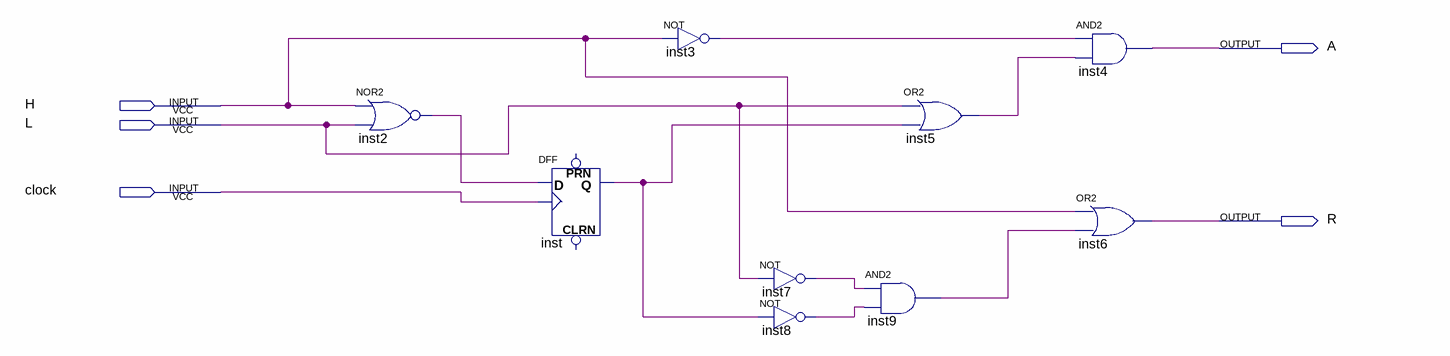
[diagram p0: schematic sheet]
// Quartus schematic robo_seguidor_de_parede.bdf as structural Verilog: 9 symbols, 5 pins
module robo_seguidor_de_parede (
  input  H,
  input  L,
  input  clock,
  output A,
  output R
);

  wire inst2_out, inst3_out, inst5_out, inst7_out, inst8_out, inst9_out, inst_q;

  nor inst2 (inst2_out, H, L);
  DFF inst (.CLK(clock), .D(inst2_out), .Q(inst_q));  // open: CLRN, PRN
  not inst3 (inst3_out, H);
  not inst7 (inst7_out, L);
  not inst8 (inst8_out, inst_q);
  or inst5 (inst5_out, L, inst_q);
  and inst9 (inst9_out, inst7_out, inst8_out);
  and inst4 (A, inst3_out, inst5_out);
  or inst6 (R, H, inst9_out);
endmodule
